# EAGLE design Meter-V2 (EAGLE 9.1.2)
COMPANY: ADAFRUIT INDUSTRIES; DRAWN: KTOWN; REV: B
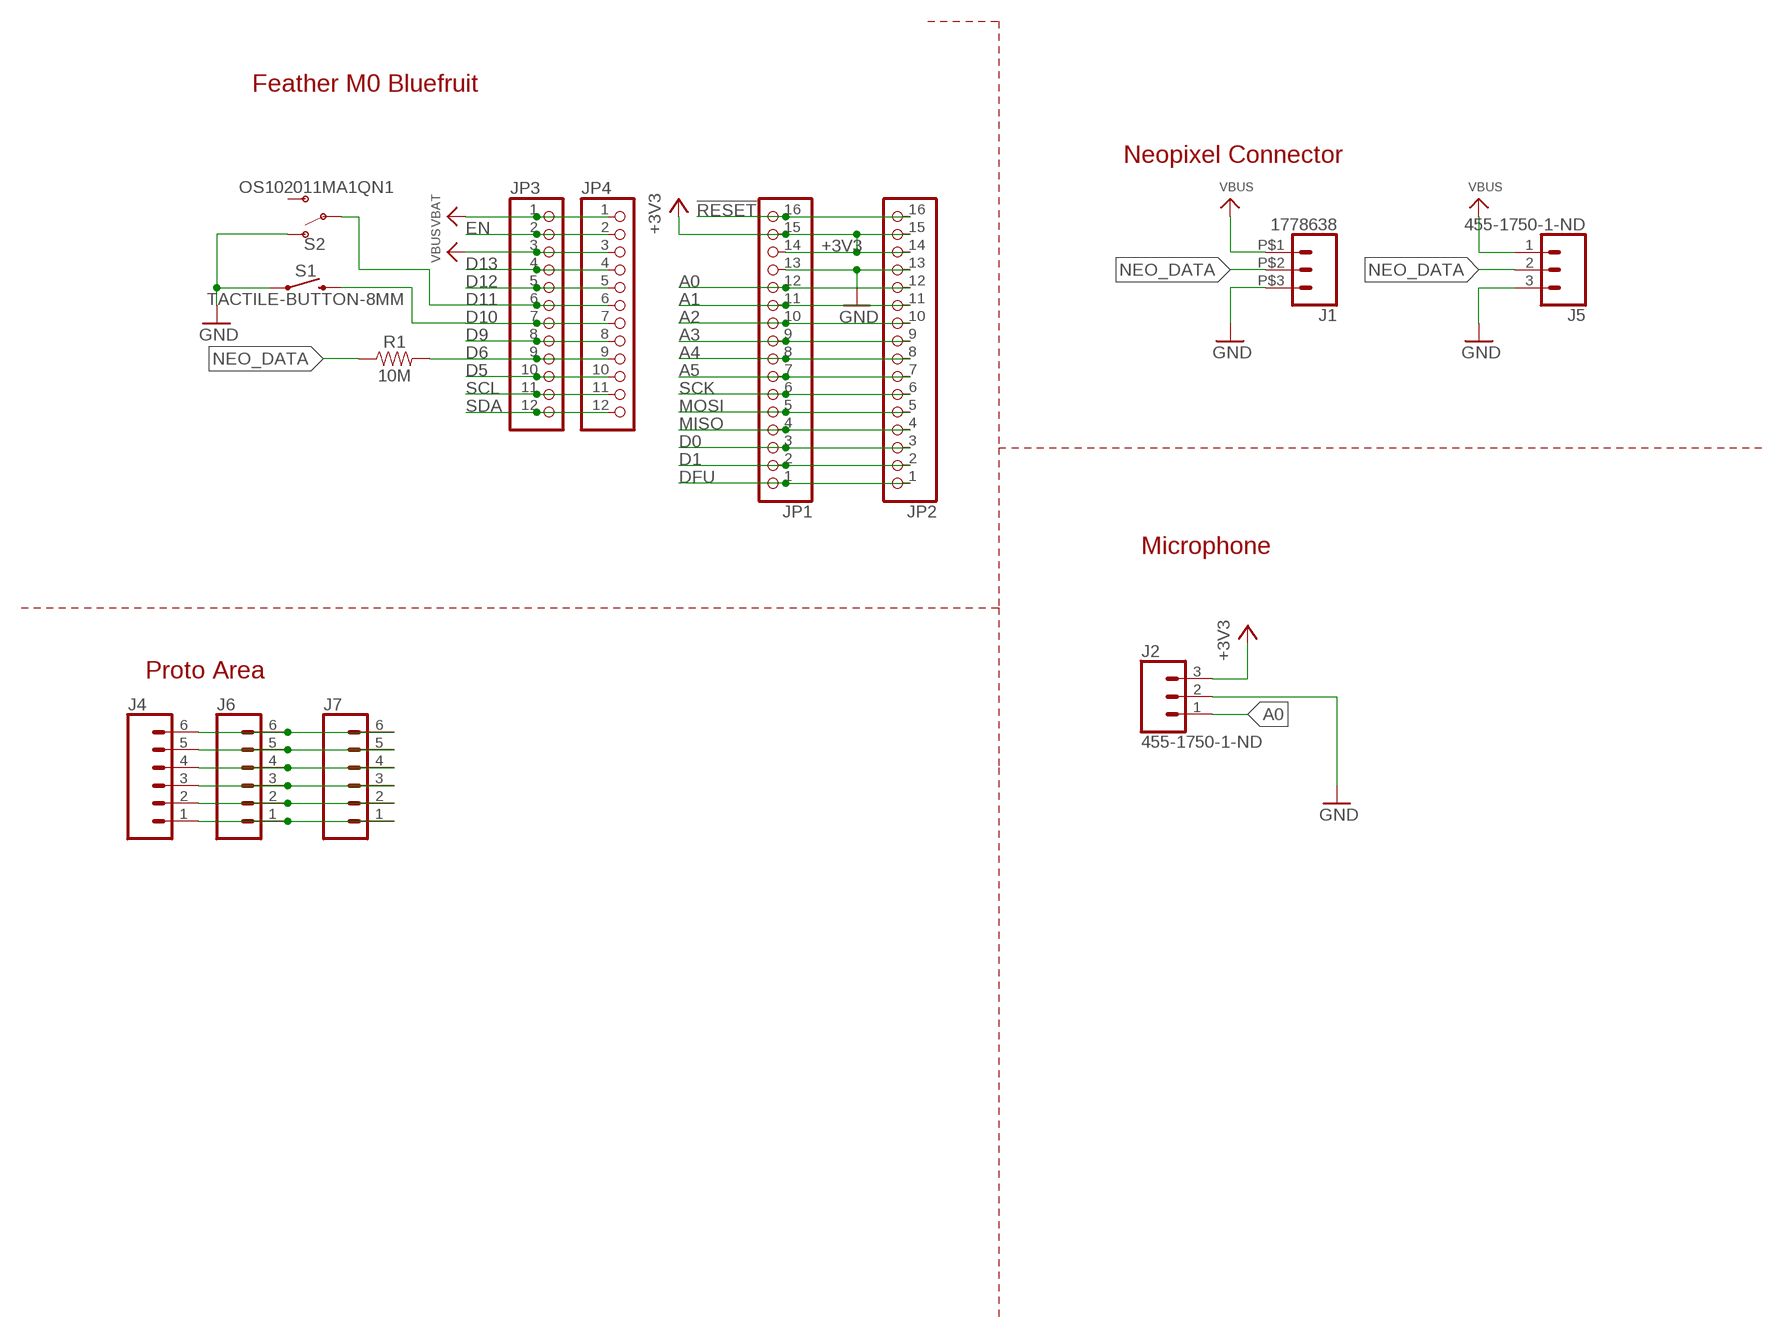
[diagram p0: schematic, sheet 1]

## Parts
J1  1778638  [1778638]
J2  455-1750-1-ND  CONN_03  [1X03]
J4  CONN_06NO_SILK_NO_POP  [1X06_NO_SILK]
J5  455-1750-1-ND  CONN_03  [1X03]
J6  CONN_06NO_SILK_NO_POP  [1X06_NO_SILK]
J7  CONN_06NO_SILK_NO_POP  [1X06_NO_SILK]
JP1  HEADER-1X16ROUND  [1X16_ROUND]
JP2  HEADER-1X16ROUND  [1X16_ROUND]
JP3  HEADER-1X12  [1X12_ROUND]
JP4  HEADER-1X12  [1X12_ROUND]
R1  10M  10MOHM-HORIZ-1/4W-5%  [AXIAL-0.3]
S1  TACTILE-BUTTON-8MM  [BUTTON-8MM]
S2  OS102011MA1QN1  [OS102011MA1QN1]

## Nets
!RESET: JP1.16 JP2.16
+3V3: J2.3 JP1.14 JP1.15 JP2.14 JP2.15
A0: J2.1 JP1.12 JP2.12
A1: JP1.11 JP2.11
A2: JP1.10 JP2.10
A3: JP1.9 JP2.9
A4: JP1.8 JP2.8
A5: JP1.7 JP2.7
D0: JP1.3 JP2.3
D1: JP1.2 JP2.2
D5: JP3.10 JP4.10
D6: JP3.9 JP4.9 R1.P$2
D9: JP3.8 JP4.8
D10: JP3.7 JP4.7 S1.P$2 S1.P$3
D11: JP3.6 JP4.6 S2.P$2(P)
D12: JP3.5 JP4.5
D13: JP3.4 JP4.4
DFU: JP1.1 JP2.1
EN: JP3.2 JP4.2
GND: J1.P$3 J2.2 J5.3 JP1.13 JP2.13 S1.P$1 S1.P$4 S2.P$1(O)
MISO: JP1.4 JP2.4
MOSI: JP1.5 JP2.5
N$1: J4.6 J6.6 J7.6
N$2: J4.5 J6.5 J7.5
N$3: J4.4 J6.4 J7.4
N$4: J4.3 J6.3 J7.3
N$5: J4.2 J6.2 J7.2
N$6: J4.1 J6.1 J7.1
NEO_DATA: J1.P$2 J5.2 R1.P$1
SCK: JP1.6 JP2.6
SCL: JP3.11 JP4.11
SDA: JP3.12 JP4.12
VBAT: JP3.1 JP4.1
VBUS: J1.P$1 J5.1 JP3.3 JP4.3
Unconnected: S2.P$3(S)

## Notes on the sheet
- Feather M0 Bluefruit
- Neopixel Connector
- Microphone
- Proto Area

## Library data of the parts
J1 = 1778638:1778638
J2 J5 = SparkFun-Connectors:CONN_03: Multi connection point. Often used as Generic Header-pin footprint for 0.1 inch spaced/style header connections On any of the 0.1 inch spaced packages, you can populate with these: Break Away Headers - Straight <https://www.sparkfun.com/products/116> (PRT-00116) Break Away Male Headers - Right Angle <https://www.sparkfun.com/products/553> (PRT-00553) Female Headers <https://www.sparkfun.com/products/115> (PRT-00115) Break Away Headers - Machine Pin <https://www.sparkfun.com/products/117> (PRT-00117) Break Away Female Headers - Swiss Machine Pin <https://www.sparkfun.com/products/743> (PRT-00743) Stackable Header - 3 Pin (Female, 0.1") <https://www.sparkfun.com/products/13875> (PRT-13875) For SCREWTERMINALS and SPRING TERMINALS visit here: Screw Terimnals on SparkFun.com <https://www.sparkfun.com/search/results?term=Screw+Terminals> (5mm/3.5mm/2.54mm spacing) This device is also useful as a general connection point to wire up your design to another part of your project. Our various solder wires solder well into these plated through hole pads. Hook-Up Wire - Assortment (Stranded, 22 AWG) <https://www.sparkfun.com/products/11375> (PRT-11375) Hook-Up Wire - Assortment (Solid Core, 22 AWG) <https://www.sparkfun.com/products/11367> (PRT-11367) View the entire wire category on our website here <https://www.sparkfun.com/categories/141> Special notes: Molex polarized connector foot print use with SKU : PRT-08232 with associated crimp pins and housings.; PROD_ID: XXX-00000
J4 J6 J7 = SparkFun-Connectors:CONN_06: Multi connection point. Often used as Generic Header-pin footprint for 0.1 inch spaced/style header connections On any of the 0.1 inch spaced packages, you can populate with these: Break Away Headers - Straight <https://www.sparkfun.com/products/116> (PRT-00116) Break Away Male Headers - Right Angle <https://www.sparkfun.com/products/553> (PRT-00553) Female Headers <https://www.sparkfun.com/products/115> (PRT-00115) Break Away Headers - Machine Pin <https://www.sparkfun.com/products/117> (PRT-00117) Break Away Female Headers - Swiss Machine Pin <https://www.sparkfun.com/products/743> (PRT-00743) Arduino Stackable Header - 6 Pin <https://www.sparkfun.com/products/9280> (PRT-09280) For SCREWTERMINALS and SPRING TERMINALS visit here: Screw Terimnals on SparkFun.com <https://www.sparkfun.com/search/results?term=Screw+Terminals> (5mm/3.5mm/2.54mm spacing) This device is also useful as a general connection point to wire up your design to another part of your project. Our various solder wires solder well into these plated through hole pads. Hook-Up Wire - Assortment (Stranded, 22 AWG) <https://www.sparkfun.com/products/11375> (PRT-11375) Hook-Up Wire - Assortment (Solid Core, 22 AWG) <https://www.sparkfun.com/products/11367> (PRT-11367) View the entire wire category on our website here <https://www.sparkfun.com/categories/141>
JP1 JP2 = microbuilder:HEADER-1X16: PIN HEADER
JP3 JP4 = microbuilder:HEADER-1X12
R1 = SparkFun-Resistors:10MOHM: RES-09327; PROD_ID: RES-09327
S1 = Adafruit_Soft_Tactile_Button:TACTILE-BUTTON-8MM
S2 = OS102011MA1QN1:OS102011MA1QN1

## Board
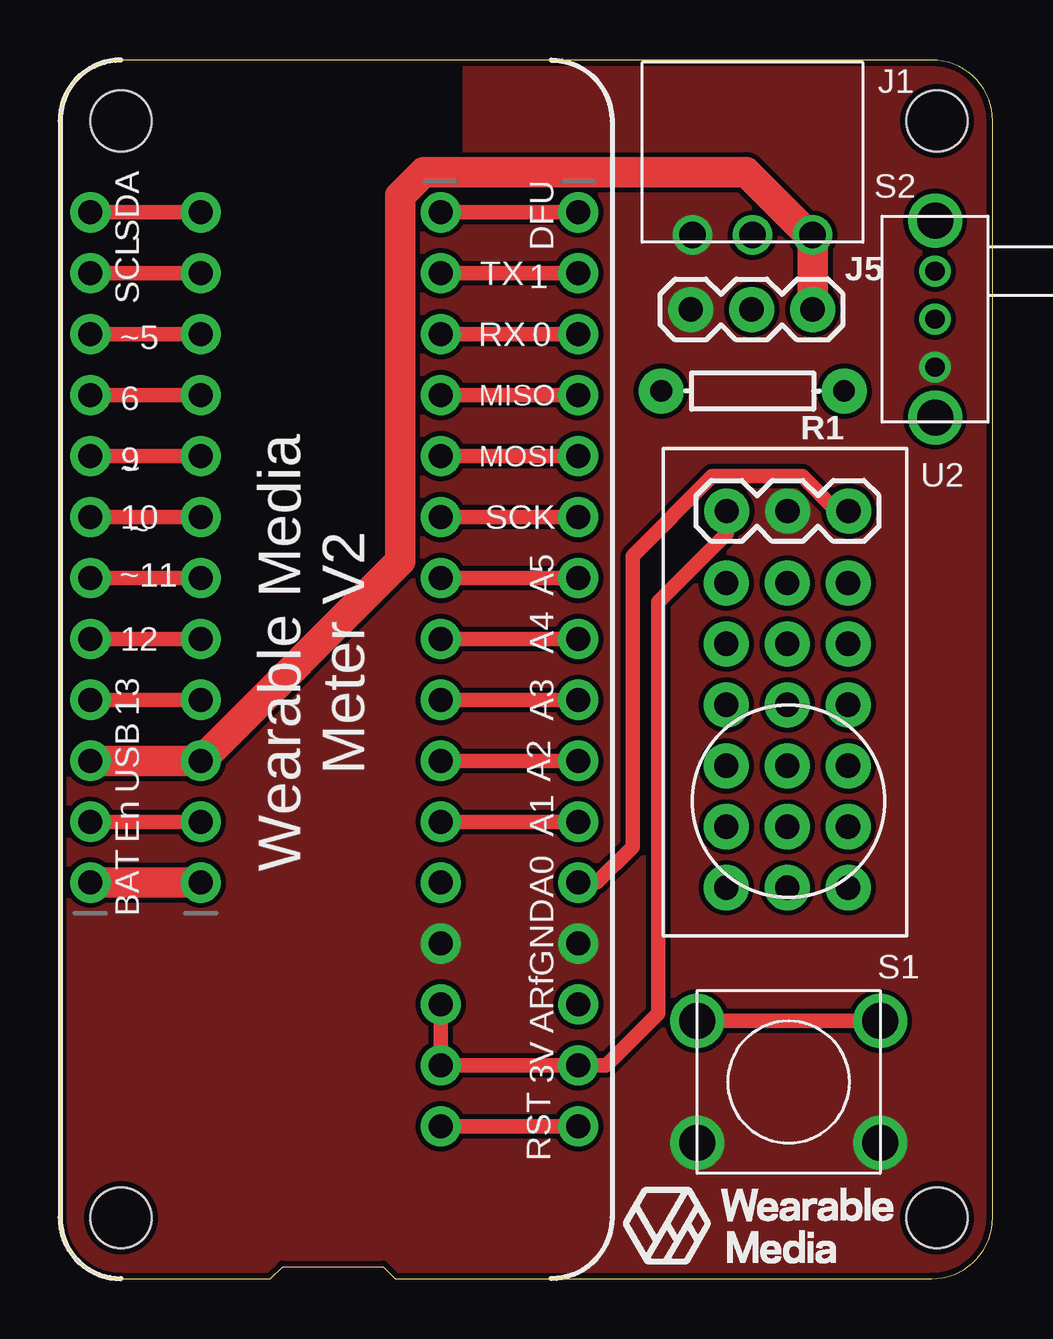
[diagram p1: board, top side]
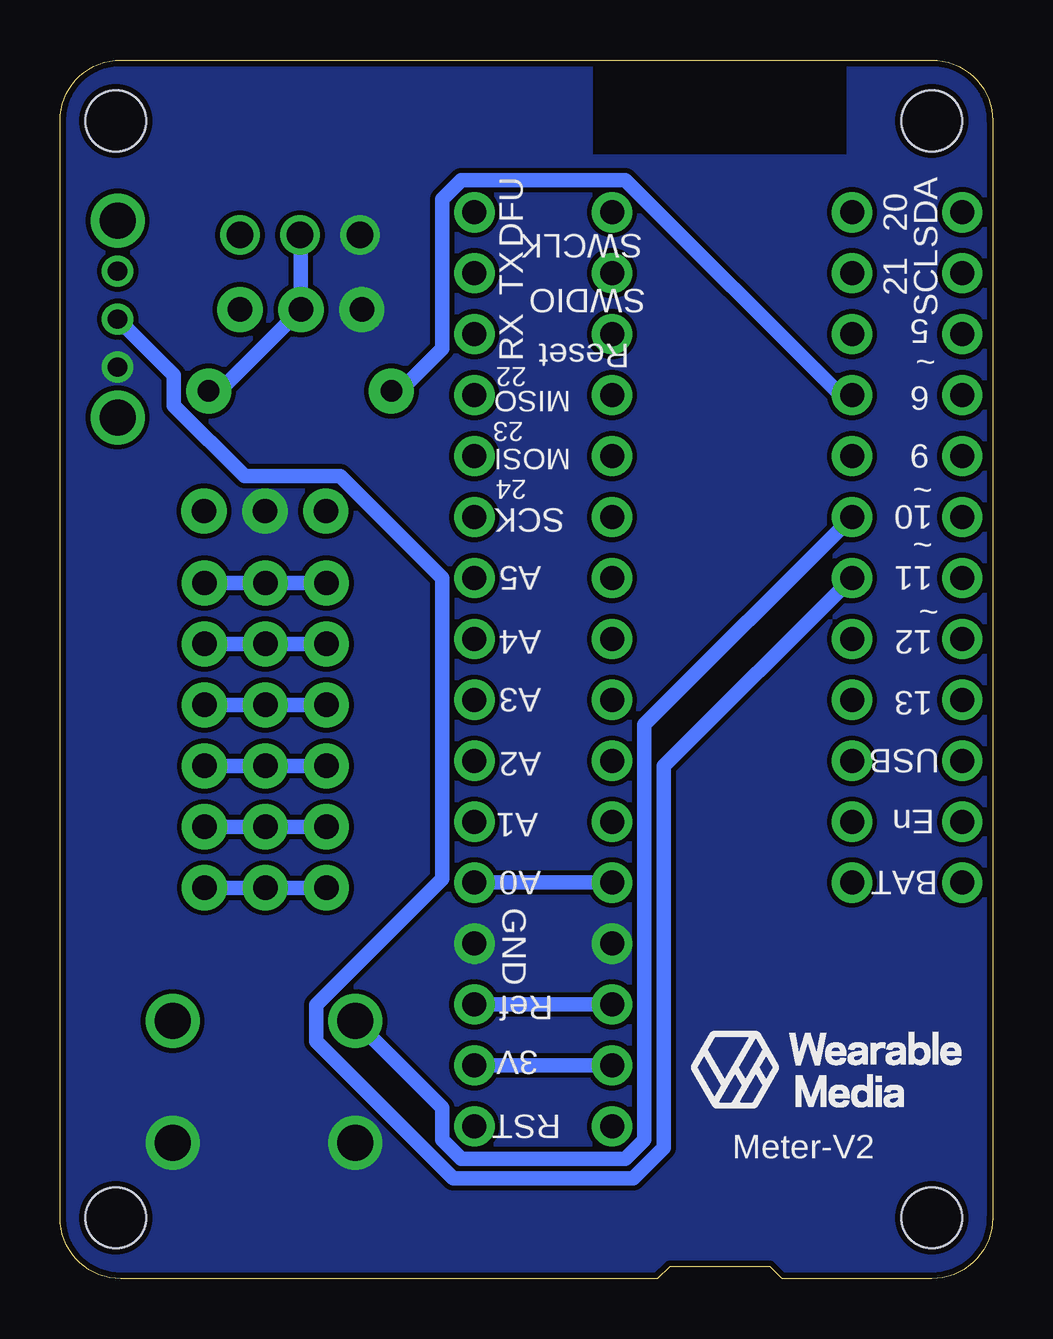
[diagram p2: board, bottom side, seen from below]

Size 38.86 x 50.8 mm. Coordinates in mm from the lower left corner, seen from the top.
Outline: 38.86,2.54 38.86,48.26 arc90 36.32,50.8 2.54,50.8 arc90 0,48.26 0,2.54 arc90 2.54,0 8.76,0 9.27,0.51 13.46,0.51 13.97,0 36.32,0 arc90 38.86,2.54
Copper layers (1*16): Top 0.035mm / dielectric 1.5mm / Bottom 0.035mm
Design rules "adafruit *": minimum track width 8mil, minimum drill 15.5mil, track to track 8mil, track to pad 8mil, pad to pad 8mil, via to via 8mil, smd to smd 8mil, copper to edge 10mil, drill to drill 8mil, minimum pad ring 10mil, minimum via ring 8mil, stop-mask expansion 2mil, vias tented up to drill 20mil, thermal gap 10mil
Holes 2.54 mm at 2.54,48.26 36.54,48.26 36.54,2.54 2.54,2.54
tRestrict: area 6.2,46.9 to 16.8,50.7
bRestrict: area 6.1,46.9 to 16.6,50.7

### Footprints (pad centres in the part's own frame; a part is rotated, then mirrored left to right if it is on the bottom)
1778638 = drill 1.1: P$1 -2.5,0; P$2 0,0; P$3 2.5,0
1X03 = drill 1.016 pad 1.88: 1 0,0; 2 2.54,0; 3 5.08,0
1X06_NO_SILK = drill 1.016 pad 1.88: 1 0,0; 2 2.54,0; 3 5.08,0; 4 7.62,0; 5 10.16,0; 6 12.7,0
1X16_ROUND = drill 1 pad 1.676: 1 -19.05,0; 2 -16.51,0; 3 -13.97,0; 4 -11.43,0; 5 -8.89,0; 6 -6.35,0; 7 -3.81,0; 8 -1.27,0; 9 1.27,0; 10 3.81,0; 11 6.35,0; 12 8.89,0; 13 11.43,0; 14 13.97,0; 15 16.51,0; 16 19.05,0
1X12_ROUND = drill 1 pad 1.676: 1 -13.97,0; 2 -11.43,0; 3 -8.89,0; 4 -6.35,0; 5 -3.81,0; 6 -1.27,0; 7 1.27,0; 8 3.81,0; 9 6.35,0; 10 8.89,0; 11 11.43,0; 12 13.97,0
AXIAL-0.3 = drill 0.9 pad 1.88: P$1 -3.81,0; P$2 3.81,0
BUTTON-8MM = drill 1.5: P$1 -2.54,-3.81; P$2 2.54,-3.81; P$3 2.54,3.81; P$4 -2.54,3.81
OS102011MA1QN1 = drill 0.8: P$1 -2,0; P$2 0,0; P$3 2,0 | drill 1.5: P$4 -4.1,0; P$5 4.1,0

### Placement (x,y rotation side)
J1  28.86,43.5 180 top
J2  32.86,32 180 top
J4  32.84,16.3 90 top
J5  31.36,40.4 180 top
J6  30.3,16.3 90 top
J7  27.76,16.3 90 top
JP1  21.59,25.4 270 top
JP2  15.86,25.4 270 top
JP3  1.27,30.48 90 top
JP4  5.86,30.48 90 top
R1  28.86,37 180 top
S1  30.36,8.2 90 top
S2  36.46,40 90 top
U$3  [WM_LOGO_MINI]  12.56,7.1 0 bottom
U$4  [WM_LOGO_MINI]  23.46,0.6 0 top

### Tracks (layer width: path | path; a pad name or v marks a point on that pad's centre or on a via)
!RESET
  Top 0.61: JP2.16 JP1.16
+3V3
  Top 0.61: 20.86,8.89 JP2.15 JP2.14 | 20.86,8.89 JP1.15 | J2.3 27.78,31.07 24.92,28.2 24.92,11.06 22.75,8.89 20.86,8.89
  Bottom 0.61: JP2.14 JP1.14 | JP2.15 JP1.15
A0
  Top 0.61: J2.1 32.37,32 30.92,33.45 27.18,33.45 23.86,30.13 23.86,18 22.37,16.51 JP1.12
  Bottom 0.61: JP2.12 JP1.12
A1
  Top 0.61: JP2.11 JP1.11
A2
  Top 0.61: JP2.10 JP1.10
A3
  Top 0.61: JP2.9 JP1.9
A4
  Top 0.61: JP2.8 JP1.8
A5
  Top 0.61: JP2.7 JP1.7
D0
  Top 0.61: JP2.3 JP1.3
D1
  Top 0.61: JP2.2 JP1.2
D5
  Top 0.61: JP3.10 JP4.10
D6
  Top 0.61: JP3.9 JP4.9
  Bottom 0.61: R1.P$2 24.88,36.83 22.94,38.77 22.94,45.01 22.15,45.8 15.3,45.8 6.34,36.83 JP4.9
D9
  Top 0.61: JP3.8 JP4.8
D10
  Top 0.61: S1.P$3 S1.P$2 | JP3.7 JP4.7
  Bottom 0.61: S1.P$3 22.94,7.13 22.94,5.79 22.15,5 15.3,5 14.51,5.79 14.51,23.1 JP4.7
D11
  Top 0.61: JP3.6 JP4.6
  Bottom 0.61: S2.P$2 34.12,37.66 34.12,36.4 31.16,33.45 27.18,33.45 22.94,29.2 22.94,16.66 28.18,11.42 28.18,9.89 22.48,4.19 14.97,4.19 13.7,5.46 13.7,21.37 JP4.6
D12
  Top 0.61: JP3.5 JP4.5
D13
  Top 0.61: JP3.4 JP4.4
DFU
  Top 0.61: JP2.1 JP1.1
EN
  Top 0.61: JP3.2 JP4.2
GND
  pour Top (no thermals): 0,0 38.86,0 38.99,50.93 0.13,50.93
  pour Bottom (no thermals): 38.86,50.93 38.86,0 0,0 0,50.93
MISO
  Top 0.61: JP2.4 JP1.4
MOSI
  Top 0.61: JP2.5 JP1.5
N$1
  Bottom 0.61: J7.6 J6.6 J4.6
N$2
  Bottom 0.61: J7.5 J6.5 J4.5
N$3
  Bottom 0.61: J7.4 J6.4 J4.4
N$4
  Bottom 0.61: J7.3 J6.3 J4.3
N$5
  Bottom 0.61: J7.2 J6.2 J4.2
N$6
  Bottom 0.61: J7.1 J6.1 J4.1
NEO_DATA
  Bottom 0.61: J1.P$2 28.82,43.46 J5.2 32.22,37 R1.P$1
SCK
  Top 0.61: JP2.6 JP1.6
SCL
  Top 0.61: JP3.11 JP4.11
SDA
  Top 0.61: JP3.12 JP4.12
VBAT
  Top 1.27: JP3.1 JP4.1
VBUS
  Top 1.27: J5.1 J1.P$1 31.21,43.5 28.59,46.13 15.17,46.13 14.18,45.14 14.18,29.91 JP4.3 JP3.3

### Text on the board
tPlace: SDA | DFU | SCL | TX | 1 | ~5 | RX | 0 | 6 | MISO | 9 | ~ | MOSI | U2 | 10 | SCK | ~ | ~11 | A5 | 12 | A4 | Wearable Media / Meter V2 | 13 | A3 | USB | A2 | En | A1 | BAT | A0 | GND | ARf | 3V | RST
bPlace: SDA | 20 | DFU | SWCLK | SCL | 21 | TX | SWDIO | 5 | RX | ~ | Reset | 22 | 6 | MISO | 23 | 9 | MOSI | ~ | 24 | 10 | SCK | ~ | 11 | A5 | ~ | 12 | A4 | 13 | A3 | USB | A2 | En | A1 | BAT | A0 | GND | Ref | 3V | RST | Meter-V2